# EAGLE design esp_board2 (EAGLE 7.7.0)
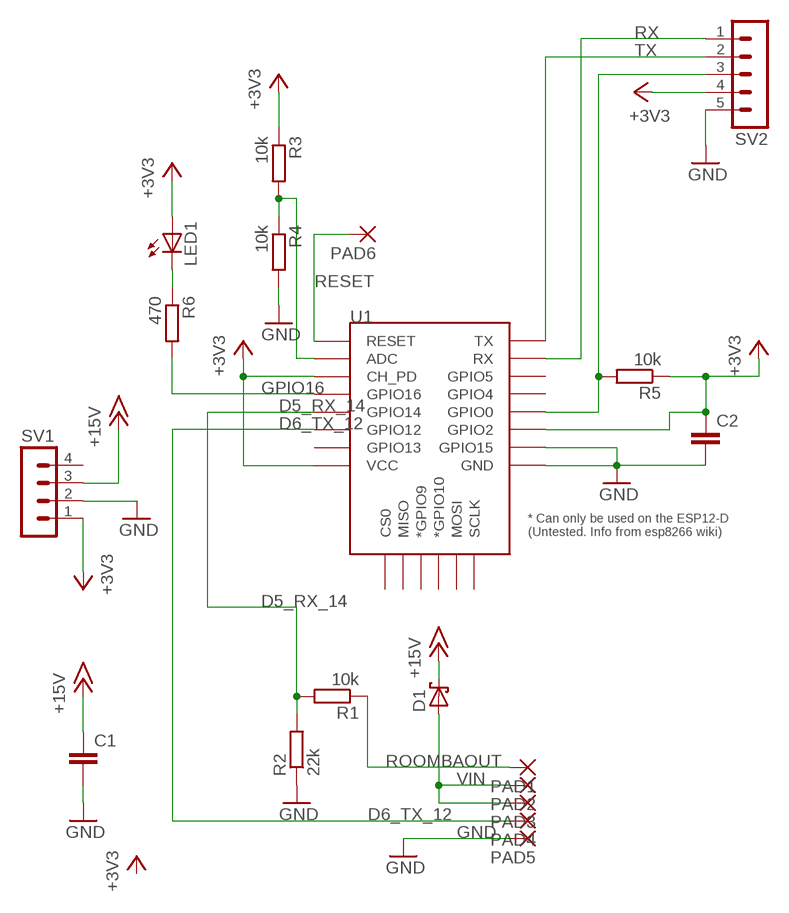
[diagram p0: schematic, sheet 1]

## Parts
C1  C-EUC3225  [C3225]
C2  C-EUC3225  [C3225]
D1  SCHOTTKY-DIODESMC  [SMC]
LED1  LEDCHIP-LED0805  [CHIP-LED0805]
PAD1  1,6/0,8  [1,6/0,8]
PAD2  1,6/0,8  [1,6/0,8]
PAD3  1,6/0,8  [1,6/0,8]
PAD4  1,6/0,8  [1,6/0,8]
PAD5  1,6/0,8  [1,6/0,8]
PAD6  SMD2  [SMD1,27-2,54]
R1  10k  R-EU_R0805  [R0805]
R2  22k  R-EU_R0805  [R0805]
R3  10k  R-EU_R0805  [R0805]
R4  10k  R-EU_R0805  [R0805]
R5  10k  R-EU_R0805  [R0805]
R6  470  R-EU_R0805  [R0805]
SV1  MA04-1  [MA04-1]
SV2  MA05-1  [MA05-1]
U1  ESP12ESMD  [ESP12E-SMD]

## Nets
+3V3: C2.1 LED1.A R3.1 R5.1 SV1.1 SV2.4 U1.CH_PD U1.GPIO2 U1.VCC
+15V: C1.1 D1.C SV1.3
ADC: R3.2 R4.1 U1.ADC
D5_RX_14: R1.2 R2.2 U1.GPIO14
D6_TX_12: PAD4.1(P) U1.GPIO12
GND: C1.2 C2.2 PAD5.1(P) R2.1 R4.2 SV1.2 SV2.5 U1.GND U1.GPIO15
GPIO0: R5.2 SV2.3 U1.GPIO0
GPIO16: R6.2 U1.GPIO16
N$2: LED1.C R6.1
RESET: PAD6.1(P) U1.RESET
ROOMBAOUT: PAD1.1(P) R1.1
RX: SV2.1 U1.RXD0(RX)
TX: SV2.2 U1.TXD0(TX)
VIN: D1.A PAD2.1(P) PAD3.1(P)
Unconnected: SV1.4 U1.CS0 U1.GPIO4 U1.GPIO5 U1.GPIO9(*GPIO9) U1.GPIO10(*GPIO10) U1.GPIO13 U1.MISO U1.MOSI U1.SCLK

## Library data of the parts
C1 C2 = rcl:C-EU: CAPACITOR, European symbol
D1 = diode:SCHOTTKY-DIODE: Schottky Diode
LED1 = led:LED: LED OSRAM: - CHIPLED LG R971, LG N971, LY N971, LG Q971, LY Q971, LO R971, LY R971 LH N974, LH R974 LS Q976, LO Q976, LY Q976 LO Q996 - Hyper CHIPLED LW Q18S LB Q993, LB Q99A, LB R99A - SideLED LS A670, LO A670, LY A670, LG A670, LP A670 LB A673, LV A673, LT A673, LW A673 LH A674 LY A675 LS A676, LA A676, LO A676, LY A676, LW A676 LS A679, LY A679, LG A679 - Hyper Micro SIDELED® LS Y876, LA Y876, LO Y876, LY Y876 LT Y87S - SmartLED LW L88C, LW L88S LB L89C, LB L89S, LG L890 LS L89K, LO L89K, LY L89K LS L896, LA L896, LO L896, LY L896 - TOPLED LS T670, LO T670, LY T670, LG T670, LP T670 LSG T670, LSP T670, LSY T670, LOP T670, LYG T670 LG T671, LOG T671, LSG T671 LB T673, LV T673, LT T673, LW T673 LH T674 LS T676, LA T676, LO T676, LY T676, LB T676, LH T676, LSB T676, LW T676 LB T67C, LV T67C, LT T67C, LS T67K, LO T67K, LY T67K, LW E67C LS E67B, LA E67B, LO E67B, LY E67B, LB E67C, LV E67C, LT E67C LW T67C LS T679, LY T679, LG T679 LS T770, LO T770, LY T770, LG T770, LP T770 LB T773, LV T773, LT T773, LW T773 LH T774 LS E675, LA E675, LY E675, LS T675 LS T776, LA T776, LO T776, LY T776, LB T776 LHGB T686 LT T68C, LB T68C - Hyper Mini TOPLED® LB M676 - Mini TOPLED Santana® LG M470 LS M47K, LO M47K, LY M47K Source: http://www.osram.convergy.de LUXEON: - LUMILED® LXK2-PW12-R00, LXK2-PW12-S00, LXK2-PW14-U00, LXK2-PW14-V00 LXK2-PM12-R00, LXK2-PM12-S00, LXK2-PM14-U00 LXK2-PE12-Q00, LXK2-PE12-R00, LXK2-PE12-S00, LXK2-PE14-T00, LXK2-PE14-U00 LXK2-PB12-K00, LXK2-PB12-L00, LXK2-PB12-M00, LXK2-PB14-N00, LXK2-PB14-P00, LXK2-PB14-Q00 LXK2-PR12-L00, LXK2-PR12-M00, LXK2-PR14-Q00, LXK2-PR14-R00 LXK2-PD12-Q00, LXK2-PD12-R00, LXK2-PD12-S00 LXK2-PH12-R00, LXK2-PH12-S00 LXK2-PL12-P00, LXK2-PL12-Q00, LXK2-PL12-R00 Source: www.luxeon.com KINGBRIGHT: KA-3528ASYC Source: www.kingbright.com
PAD1-PAD5 = wirepad:1,6/0,8: THROUGH-HOLE PAD
PAD6 = wirepad:SMD2: SMD PAD
R1-R6 = rcl:R-EU_: RESISTOR, European symbol
SV1 = con-lstb:MA04-1: PIN HEADER; OC_FARNELL: unknown; OC_NEWARK: unknown
SV2 = con-lstb:MA05-1: PIN HEADER; OC_FARNELL: unknown; OC_NEWARK: unknown
U1 = esp8266modules:ESP12E: ESP12E Module

## Board
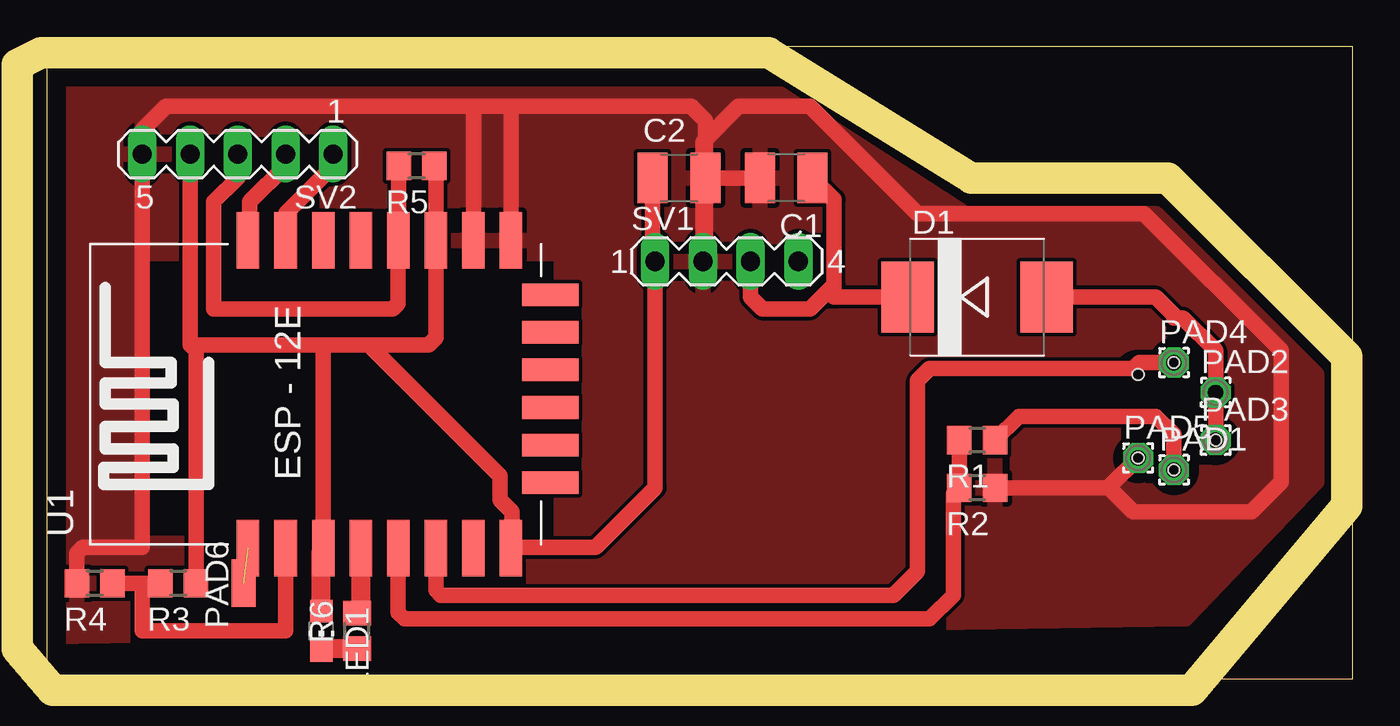
[diagram p1: board, top side]

Size 69.52 x 33.65 mm. Coordinates in mm from the lower left corner, seen from the top.
Outline: 0,0 69.52,0 69.52,33.65 0,33.65 0,0
Copper layers (1*16): Top 0.035mm / dielectric 1.5mm / Bottom 0.035mm
Design rules "default": minimum track width 10mil, minimum drill 24mil, track to track 8mil, track to pad 8mil, pad to pad 8mil, via to via 8mil, smd to smd 8mil, copper to edge 40mil, drill to drill 8mil, minimum pad ring 10mil, minimum via ring 8mil, stop-mask expansion 4mil, vias tented up to drill 0mil, thermal gap 10mil
Holes 0.6 mm at 60.01,16.83 58.1,16.19 58.1,11.75 60.01,11.11 62.23,12.7
tRestrict: area 5.4,7.6 to 27,22.2
Milling: 10 lines

### Footprints (pad centres in the part's own frame; a part is rotated, then mirrored left to right if it is on the bottom)
C3225 = smd 1.6 x 2.7: 1 -1.4,0; 2 1.4,0
SMC = smd 2.8 x 3.8: A 3.7,0; C -3.7,0
CHIP-LED0805 = smd 1.2 x 1.2: A 0,-1.05; C 0,1.05
1,6/0,8 = drill 0.813 pad 1.6 octagon: 1 0,0
SMD1,27-2,54 = smd 1.27 x 2.54: 1 0,0
R0805 = smd 1.3 x 1.5: 1 -0.95,0; 2 0.95,0
MA04-1 = drill 1.016 long: 1 -3.81,0; 2 -1.27,0; 3 1.27,0; 4 3.81,0
MA05-1 = drill 1.016 long: 1 -5.08,0; 2 -2.54,0; 3 0,0; 4 2.54,0; 5 5.08,0
ESP12E-SMD = smd 3 x 1.2: ADC -8.3,3.8; CH_PD -8.3,1.8; GND 8.1,-8.2; GPIO0 8.1,-2.2; GPIO2 8.1,-4.2; GPIO4 8.1,-0.2; GPIO5 8.1,1.8; GPIO12 -8.3,-4.2; GPIO13 -8.3,-6.2; GPIO14 -8.3,-2.2; GPIO15 8.1,-6.2; GPIO16 -8.3,-0.2; RESET -8.3,5.8; RXD0 8.1,3.8; TXD0 8.1,5.8; VCC -8.3,-8.2 | smd 1.2 x 3: CS0 -4.8,-10.3; GPIO9 -0.8,-10.3; GPIO10 1.2,-10.3; MISO -2.8,-10.3; MOSI 3.2,-10.3; SCLK 5.2,-10.3

### Placement (x,y rotation side)
C1  39.37,26.67 180 top
C2  33.66,26.67 0 top
D1  49.53,20.32 0 top
LED1  14.6,2.54 180 top
PAD1  60.01,11.11 0 top
PAD2  62.23,15.24 0 top
PAD3  62.23,12.7 0 top
PAD4  60.01,16.83 0 top
PAD5  58.1,11.75 0 top
PAD6  10.48,5.08 0 top
R1  49.53,12.7 180 top
R2  49.53,10.16 180 top
R3  6.99,5.08 180 top
R4  2.54,5.08 180 top
R5  19.69,27.3 180 top
R6  16.51,2.54 90 top
SV1  36.2,22.22 0 top
SV2  10.16,27.94 180 top
U1  16.51,15.24 90 top

### Tracks (layer width: path | path; a pad name or v marks a point on that pad's centre or on a via)
+3V3
  Top 0.813: SV2.4 7.62,17.78 | 7.62,17.78 14.6,17.78 | 14.6,17.78 17.15,17.78 | 17.15,17.78 24.13,10.79 24.13,9.52 24.77,8.89 24.77,7 | 24.77,7 U1.VCC | 24.77,7 29.22,7 32.38,10.16 SV1.1 32.25,22.36 C2.1 | U1.CH_PD 14.71,17.68 14.6,17.78 | 17.15,17.78 20.32,17.78 20.71,18.17 U1.GPIO2 20.71,27.23 R5.1 | R3.1 7.94,17.46 7.62,17.78
  Top 1.016: LED1.A 14.6,6.83 U1.CH_PD
+15V
  Top 0.813: SV1.3 37.46,20.32 38.1,19.68 40.64,19.68 41.91,20.95 | 41.91,20.95 41.91,20.32 D1.C | 41.91,20.95 41.91,25.53 C1.1
ADC
  Top 0.813: R4.1 5.08,5.08 | 5.08,5.08 R3.2 | U1.ADC 12.71,2.55 12.06,2.54 5.08,2.54 5.08,5.08
D5_RX_14
  Top 0.813: U1.GPIO14 18.71,3.51 19.05,3.17 46.99,3.17 48.26,4.44 48.26,9.84 R2.2 R1.2
D6_TX_12
  Top 0.813: U1.GPIO12 20.71,4.69 20.95,4.44 45.09,4.44 46.35,5.72 46.35,15.88 46.99,16.51 57.85,16.51 58.17,16.83 PAD4.1
GND
  Top 0.813: 24.77,30.48 34.29,30.48 35.05,29.71 C2.2 | 24.77,30.48 22.86,30.48 | 22.86,30.48 6.35,30.48 5.08,29.21 SV2.5 5.08,6.99 1.9,6.99 1.59,6.67 R4.2 | C2.2 35.05,22.36 SV1.2 34.92,28.57 36.83,30.48 40.64,30.48 46.35,24.76 58.42,24.76 65.72,17.46 65.72,10.48 64.14,8.89 57.85,8.89 56.58,10.16 | C2.2 C1.2 | R2.1 56.58,10.16 | U1.GPIO15 22.71,30.33 22.86,30.48 | U1.GND 24.71,30.43 24.77,30.48 | 56.58,10.16 56.58,10.22 PAD5.1
  pour Top: 0,31.11 39.05,31.11 48.89,24.76 59.05,24.76 67.63,16.19 67.63,10.48 60.64,3.17 0,2.22
GPIO0
  Top 0.813: R5.2 18.73,23.36 U1.GPIO0 18.71,19.98 18.41,19.68 8.89,19.68 8.89,25.4 10.16,26.67 SV2.3
GPIO16
  Top 1.016: U1.GPIO16 16.71,3.69 R6.2
N$2
  Top 1.016: R6.1 14.71,1.59 LED1.C
RESET  (1 unrouted)
ROOMBAOUT
  Top 0.813: R1.1 51.75,13.97 59.05,13.97 60.01,13.02 PAD1.1
RX
  Top 0.813: U1.RXD0 12.71,24.78 15.24,27.3 SV2.1
TX
  Top 0.813: U1.TXD0 10.79,23.34 10.79,25.4 12.7,27.3 SV2.2
VIN
  Top 0.813: D1.A 59.05,20.32 60.09,19.29 60.01,19.2 60.49,19.2 62.23,17.46 PAD2.1 PAD3.1